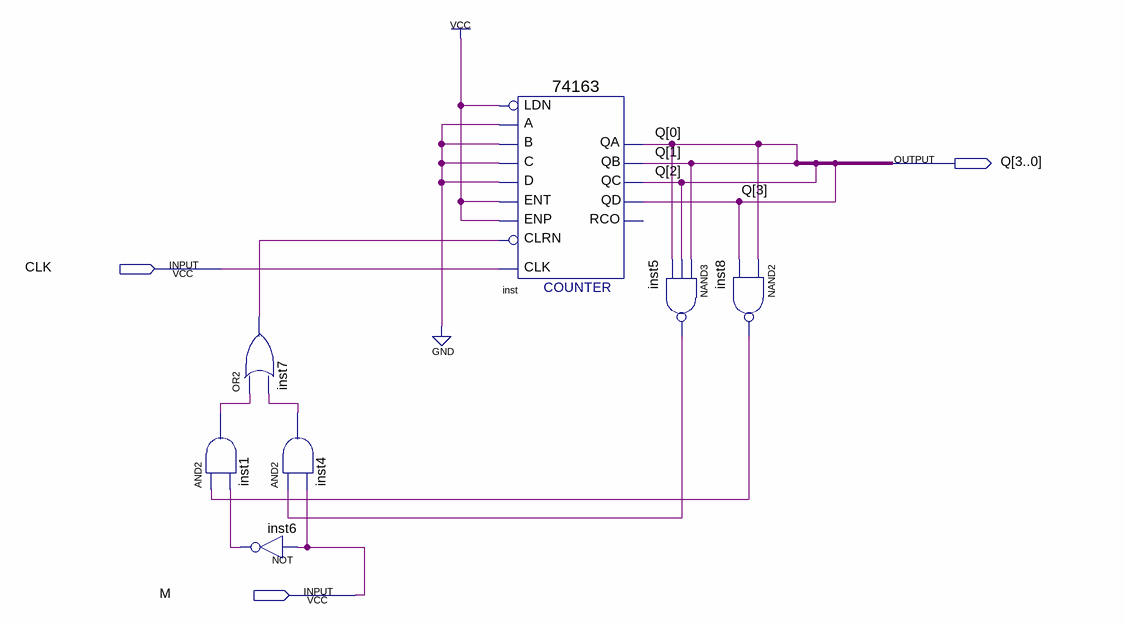
[diagram p0: schematic sheet]
// Quartus schematic SpecialCount.bdf as structural Verilog: 7 symbols, 3 pins
module SpecialCount (
  input  CLK,
  input  M,
  output [3:0] Q
);

  wire inst1_out, inst4_out, inst5_out, inst6_out, inst7_out, inst8_out;

  and inst1 (inst1_out, inst8_out, inst6_out);
  or inst7 (inst7_out, inst1_out, inst4_out);
  and inst4 (inst4_out, inst5_out, M);
  not inst6 (inst6_out, M);
  \74163  inst (
    .C(1'b0), .B(1'b0), .A(1'b0), .ENT(1'b1), .D(1'b0), .CLRN(inst7_out), .CLK(CLK), .ENP(1'b1), .LDN(1'b1),
    .QA(Q[0]), .QB(Q[1]), .QC(Q[2]), .QD(Q[3]));  // open: RCO
  nand inst5 (inst5_out, Q[1], Q[2], Q[0]);
  nand inst8 (inst8_out, Q[0], Q[3]);
endmodule
